# EAGLE design Board1 (EAGLE 7.5.0)
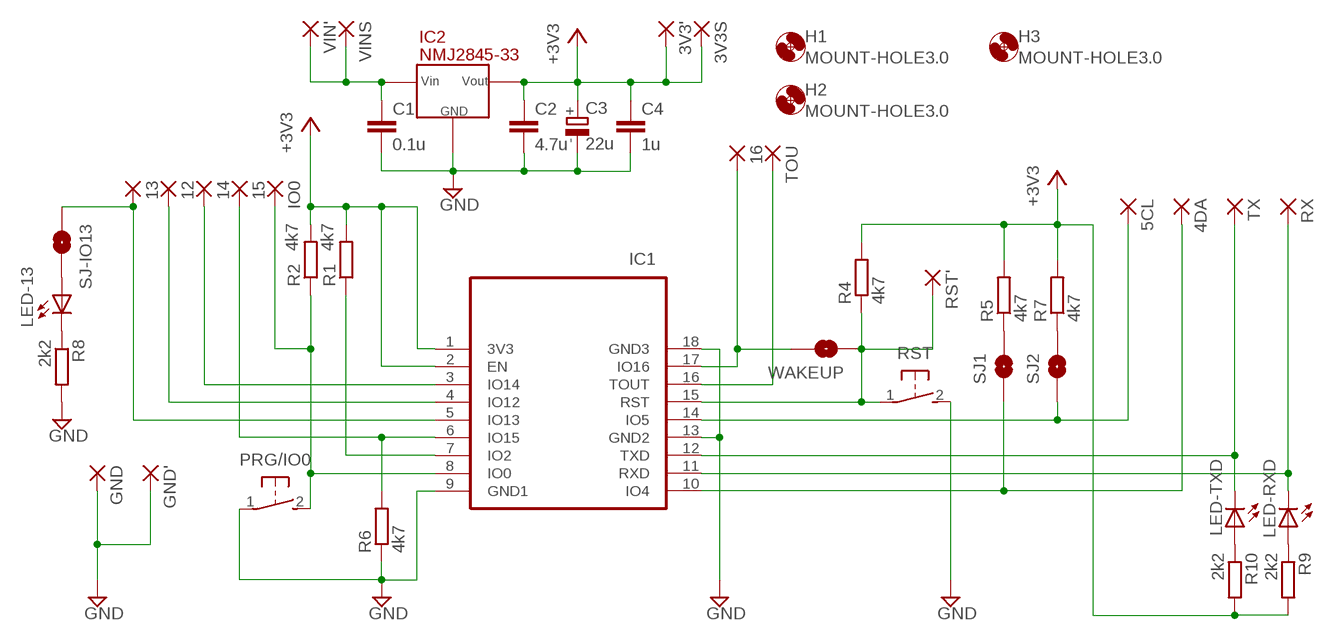
[diagram p0: schematic, sheet 1]

## Parts
3V3'  1,6/0,8  [1,6/0,8]
3V3S  1,6/0,8  [1,6/0,8]
4DA  1,6/0,8  [1,6/0,8]
5CL  1,6/0,8  [1,6/0,8]
12  1,6/0,8  [1,6/0,8]
13  1,6/0,8  [1,6/0,8]
14  1,6/0,8  [1,6/0,8]
15  1,6/0,8  [1,6/0,8]
16  1,6/0,8  [1,6/0,8]
C1  0.1u  C-EUC0603  [C0603]
C2  4.7u  C-EUC0805  [C0805]
C3  22u  OS-CON/C6C  [C6]
C4  1u  C-EUC0603  [C0603]
GND  1,6/0,8  [1,6/0,8]
GND'  1,6/0,8  [1,6/0,8]
H1  MOUNT-HOLE3.0  [3,0]
H2  MOUNT-HOLE3.0  [3,0]
H3  MOUNT-HOLE3.0  [3,0]
IC1  ESP-WROOM-02FRONT-FACE  [FRONT-FACE]
IC2  NMJ2845-33  NJM2845DL1  [TO-252-3]
IO0  1,6/0,8  [1,6/0,8]
LED-13  IO13  LEDCHIP-LED0603  [CHIP-LED0603]
LED-RXD  R  LEDCHIP-LED0603  [CHIP-LED0603]
LED-TXD  T  LEDCHIP-LED0603  [CHIP-LED0603]
PRG/IO0  SWITCH-TACTILESW  [SWITCH-TACTILE]
R1  4k7  R-EU_R0603  [R0603]
R2  4k7  R-EU_R0603  [R0603]
R4  4k7  R-EU_R0603  [R0603]
R5  4k7  R-EU_R0603  [R0603]
R6  4k7  R-EU_R0603  [R0603]
R7  4k7  R-EU_R0603  [R0603]
R8  2k2  R-EU_R0603  [R0603]
R9  2k2  R-EU_R0603  [R0603]
R10  2k2  R-EU_R0603  [R0603]
RST  SWITCH-TACTILESW  [SWITCH-TACTILE]
RST'  1,6/0,8  [1,6/0,8]
RX  1,6/0,8  [1,6/0,8]
SJ1  SDA/PU  SOLDERJUMPERNO  [SJ_2S-NO]
SJ2  SCL/PU  SOLDERJUMPERNO  [SJ_2S-NO]
SJ-IO13  SOLDERJUMPERNO  [SJ_2S-NO]
TOU  1,6/0,8  [1,6/0,8]
TX  1,6/0,8  [1,6/0,8]
VIN'  1,6/0,8  [1,6/0,8]
VINS  1,6/0,8  [1,6/0,8]
WAKEUP  SOLDERJUMPERNO  [SJ_2S-NO]

## Nets
+3V3 [3V3]: 3V3'.1(P) 3V3S.1(P) C2.1 C3.+ C4.1 IC1.1(3V3) IC1.2(EN) IC2.VOUT R1.2 R2.2 R4.2 R5.2 R7.2 R9.2 R10.2
GND [GND]: C1.2 C2.2 C3.- C4.2 GND'.1(P) GND.1(P) IC1.9(GND1) IC1.13(GND2) IC1.18(GND3) IC2.GND PRG/IO0.1 R6.1 R8.2 RST.2
N$2: IC1.8(IO0) IO0.1(P) PRG/IO0.2 R2.1
N$3: IC1.7(IO2) R1.1
N$4: 4DA.1(P) IC1.10(IO4) SJ1.1
N$5: IC1.11(RXD) LED-RXD.C RX.1(P)
N$6: IC1.12(TXD) LED-TXD.C TX.1(P)
N$7: 5CL.1(P) IC1.14(IO5) SJ2.1
N$8: IC1.15(RST) R4.1 RST'.1(P) RST.1 WAKEUP.1
N$9: IC1.16(TOUT) TOU.1(P)
N$10: 16.1(P) IC1.17(IO16) WAKEUP.2
N$11: R5.1 SJ1.2
N$12: R7.1 SJ2.2
N$13: 14.1(P) IC1.3(IO14)
N$14: 15.1(P) IC1.6(IO15) R6.2
N$15: 12.1(P) IC1.4(IO12)
N$16: 13.1(P) IC1.5(IO13) SJ-IO13.1
N$17 [Vin]: C1.1 IC2.VIN VIN'.1(P) VINS.1(P)
N$18: LED-13.A SJ-IO13.2
N$19: LED-13.C R8.1
N$22: LED-TXD.A R10.1
N$24: LED-RXD.A R9.1

## Library data of the parts
3V3' 3V3S 4DA 5CL 12-16 GND GND' IO0 RST' RX TOU TX VIN' VINS = wirepad:1,6/0,8: THROUGH-HOLE PAD
C1 C4 = _temp:C-EU: CAPACITOR, European symbol
C2 = resistor:C-EU: CAPACITOR, European symbol
C3 = OS-CON:OS-CON/C6
H1-H3 = holes:MOUNT-HOLE: MOUNTING HOLE with drill center marker
IC1 = esp-wroom-02:ESP-WROOM-02: WiFi module - ESP-WROOM-02
IC2 = NJM2845DL1:NJM2845DL1: New JRC NJM2845DL1 LDO Three-terminal regulator.
LED-13 LED-RXD LED-TXD = adafruit:LED: LED OSRAM: - CHIPLED LG R971, LG N971, LY N971, LG Q971, LY Q971, LO R971, LY R971 LH N974, LH R974 LS Q976, LO Q976, LY Q976 LO Q996 - Hyper CHIPLED LW Q18S LB Q993, LB Q99A, LB R99A - SideLED LS A670, LO A670, LY A670, LG A670, LP A670 LB A673, LV A673, LT A673, LW A673 LH A674 LY A675 LS A676, LA A676, LO A676, LY A676, LW A676 LS A679, LY A679, LG A679 - Hyper Micro SIDELED® LS Y876, LA Y876, LO Y876, LY Y876 LT Y87S - SmartLED LW L88C, LW L88S LB L89C, LB L89S, LG L890 LS L89K, LO L89K, LY L89K LS L896, LA L896, LO L896, LY L896 - TOPLED LS T670, LO T670, LY T670, LG T670, LP T670 LSG T670, LSP T670, LSY T670, LOP T670, LYG T670 LG T671, LOG T671, LSG T671 LB T673, LV T673, LT T673, LW T673 LH T674 LS T676, LA T676, LO T676, LY T676, LB T676, LH T676, LSB T676, LW T676 LB T67C, LV T67C, LT T67C, LS T67K, LO T67K, LY T67K, LW E67C LS E67B, LA E67B, LO E67B, LY E67B, LB E67C, LV E67C, LT E67C LW T67C LS T679, LY T679, LG T679 LS T770, LO T770, LY T770, LG T770, LP T770 LB T773, LV T773, LT T773, LW T773 LH T774 LS E675, LA E675, LY E675, LS T675 LS T776, LA T776, LO T776, LY T776, LB T776 LHGB T686 LT T68C, LB T68C - Hyper Mini TOPLED® LB M676 - Mini TOPLED Santana® LG M470 LS M47K, LO M47K, LY M47K Source: http://www.osram.convergy.de/
PRG/IO0 RST = tact-switch-2p:SWITCH-TACTILE: tactile switch - 2p
R1 R2 R4-R10 = _temp:R-EU_: RESISTOR, European symbol
SJ1 SJ2 SJ-IO13 WAKEUP = SparkFun:SOLDERJUMPER: Solder Jumper Standard SMD solder jumper. Used to automate production. Two varients : Normally Open and Normally Closed are the same, but have different paste layers. NC will have a large amount of paste and should jumper during reflow.

## Net classes
1 GND: width 0.61 mm
2 3V3: width 0.61 mm
3 Vin: width 0.61 mm

## Board
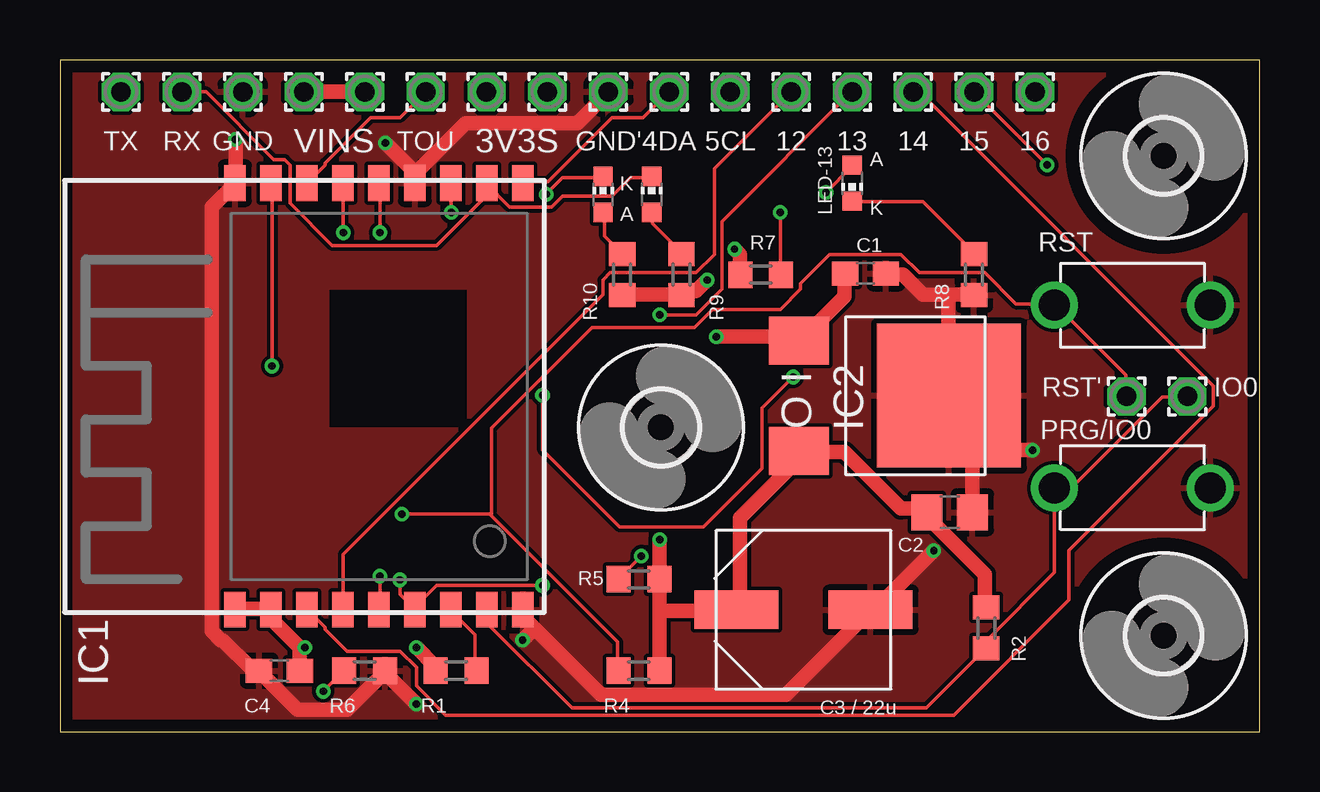
[diagram p1: board, top side]
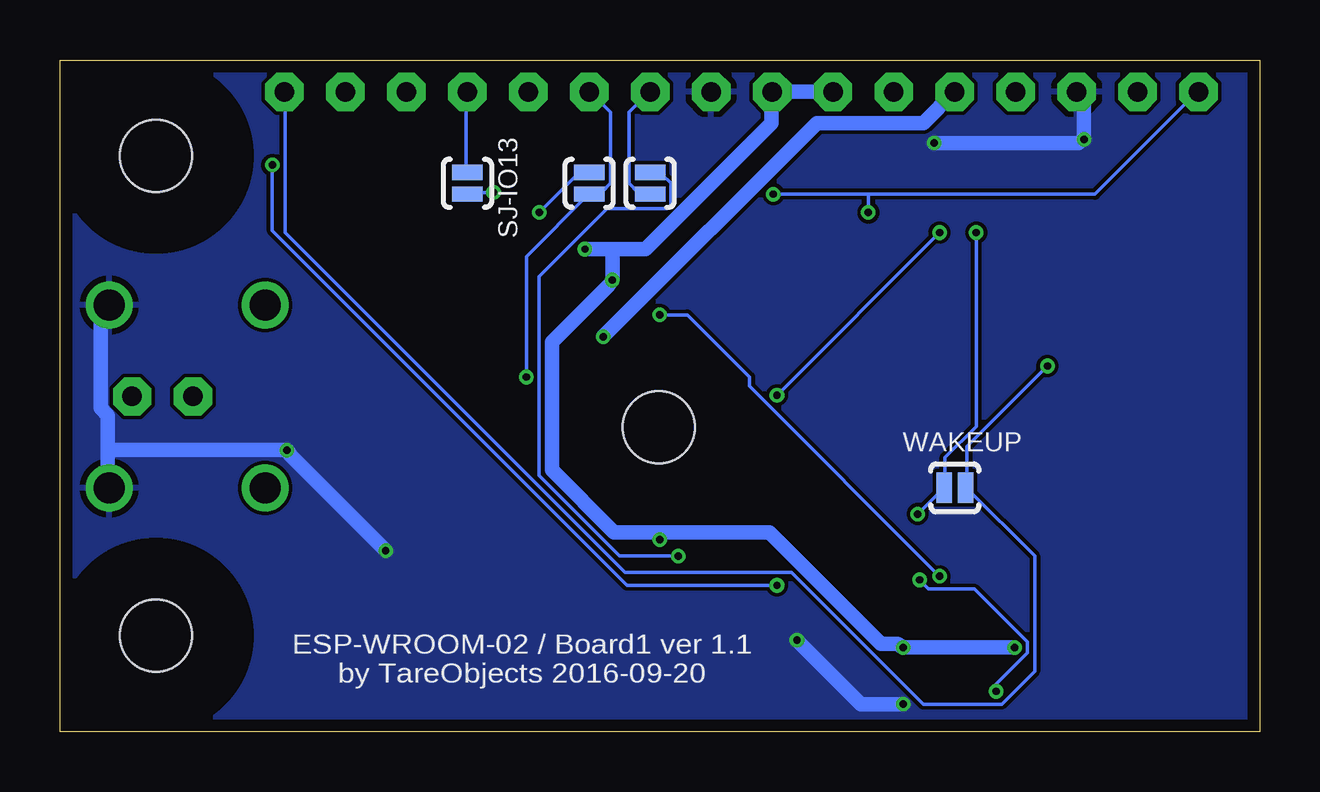
[diagram p2: board, bottom side, seen from below]

Size 50 x 28 mm. Coordinates in mm from the lower left corner, seen from the top.
Outline: 0,0 50,0 50,28 0,28 0,0
Copper layers (1*16): Top 0.035mm / dielectric 1.6mm / Bottom 0.035mm
Design rules "Elecrow_2-layer_PCB_eagle_rule": minimum track width 6mil, minimum drill 12mil, track to track 6mil, track to pad 6mil, pad to pad 6mil, via to via 8mil, smd to smd 0mil, copper to edge 20mil, drill to drill 10mil, minimum pad ring 6mil, minimum via ring 6mil, stop-mask expansion 0mil, vias tented up to drill 100mil, thermal gap 10mil

### Footprints (pad centres in the part's own frame; a part is rotated, then mirrored left to right if it is on the bottom)
1,6/0,8 = drill 0.813 pad 1.6 octagon: 1 0,0
C0603 = smd 1.1 x 1: 1 -0.85,0; 2 0.85,0
C0805 = smd 1.3 x 1.5: 1 -0.95,0; 2 0.95,0
C6 = smd 1.6 x 3.5: + 0,-2.8; - 0,2.8
3,0 = hole 3: 0,0
FRONT-FACE = smd 1.485 x 0.9: 1 -8.893,4.9; 2 -8.893,3.4; 3 -8.893,1.9; 4 -8.893,0.4; 5 -8.893,-1.1; 6 -8.893,-2.6; 7 -8.893,-4.1; 8 -8.893,-5.6; 9 -8.893,-7.1; 10 8.893,-7.1; 11 8.893,-5.6; 12 8.893,-4.1; 13 8.893,-2.6; 14 8.893,-1.1; 15 8.893,0.4; 16 8.893,1.9; 17 8.893,3.4; 18 8.893,4.9
TO-252-3 = smd 6 x 6: GND 0,1.5 | smd 2 x 2.5: VIN -2.3,-4.75; VOUT 2.3,-4.75
CHIP-LED0603 = smd 0.8 x 0.8: A 0,-0.75; C 0,0.75
SWITCH-TACTILE = drill 1.3: 1 -3.25,0; 2 3.25,0
R0603 = smd 1 x 1.1: 1 -0.85,0; 2 0.85,0
SJ_2S-NO = smd 0.635 x 1.27: 1 -0.45,0; 2 0.45,0

### Placement (x,y rotation side)
3V3'  17.78,26.67 0 top
3V3S  20.32,26.67 180 top
4DA  25.4,26.67 180 top
5CL  27.94,26.67 0 top
12  30.48,26.67 180 top
13  33.02,26.67 180 top
14  35.56,26.67 180 top
15  38.1,26.67 0 top
16  40.64,26.67 180 top
C1  33.58,19.1 0 top
C2  37.08,9.14 0 top
C3  30.99,5.08 270 top
C4  9.14,2.54 180 top
GND  7.62,26.67 0 top
GND'  22.86,26.67 0 top
H1  46,4 0 top
H2  46,24 0 top
H3  25.05,12.68 0 top
IC1  12.19,13.97 90 top
IC2  35.56,14 270 top
IO0  46.99,13.97 0 top
LED-13  33.02,22.86 180 top
LED-RXD  24.67,22.4 0 top
LED-TXD  22.64,22.4 0 top
PRG/IO0  44.7,10.16 180 top
R1  16.51,2.54 180 top
R2  38.61,4.32 90 top
R4  24.13,2.54 0 top
R5  24.13,6.35 0 top
R6  12.7,2.54 180 top
R7  29.21,19.05 180 top
R8  38.1,19.05 270 top
R9  25.91,19.05 270 top
R10  23.43,19.05 270 top
RST  44.7,17.78 0 top
RST'  44.45,13.97 0 top
RX  5.08,26.67 90 top
SJ1  25.4,22.86 90 bottom
SJ2  27.94,22.86 90 bottom
SJ-IO13  33.02,22.86 270 bottom
TOU  15.24,26.67 180 top
TX  2.54,26.67 90 top
VIN'  12.7,26.67 0 top
VINS  10.16,26.67 180 top
WAKEUP  12.7,10.16 0 bottom

### Tracks (layer width: path | path; a pad name or v marks a point on that pad's centre or on a via)
+3V3  (via drill 0.3)
  Top 0.61: 24.99,5.03 24.99,6.33 R5.2 24.99,6.63 v24.99,8 | 24.99,5.03 24.99,2.59 R4.2 | 24.99,5.03 28.12,5.03 C3.+ 28.35,5.33 28.35,8.91 30.79,11.35 IC2.VOUT 30.86,11.66 32.69,11.66 35.05,9.3 35.89,9.3 C2.1 36.2,9.14 36.2,8.91 38.56,6.55 38.56,5.18 R2.2 | 9.98,3.5 9.98,2.59 C4.1 | 9.98,3.5 8.84,4.65 8.84,5.03 IC1.2 8.53,5.11 7.32,5.11 IC1.1 | v14.86,3.5 15.62,2.74 15.62,2.59 R1.2 | v10.21,3.5 9.98,3.5 | R10.2 23.47,18.21 25.91,18.21 R9.2 26.14,18.36 26.52,18.36 v26.98,18.82 | v28.12,20.12 28.35,19.89 28.35,19.05 R7.2
  Bottom 0.61: v10.21,3.5 v14.86,3.5 15.09,3.66 15.77,3.66 20.42,8.31 24.99,8.31 | 26.98,20.12 25.6,20.12 20.34,25.38 20.34,26.67 3V3S.1 3V3'.1 | 26.98,20.12 v28.12,20.12 | 26.98,20.12 v26.98,18.82 27.13,18.59 29.49,16.23 29.49,10.9 26.9,8.31 24.99,8.31 | v24.99,8 24.99,8.31
GND  (via drill 0.3)
  Top 0.61: GND'.1 21.57,25.38 16.92,25.38 14.86,23.32 14.86,22.94 IC1.13 14.63,23.47 v13.56,24.54 | v7.32,24.69 7.32,22.94 IC1.18 7.09,22.63 6.33,21.87 6.33,4.19 6.71,3.81 6.78,3.81 8,2.59 C4.2 8.31,2.52 9.91,0.91 11.96,0.91 13.56,2.52 R6.1 13.72,2.29 v14.86,1.14 | 19.77,4.3 22.55,1.52 30.25,1.52 33.76,5.03 C3.- 34.06,5.18 v36.42,7.54 | 19.77,4.3 19.36,4.72 19.36,5.03 IC1.9 | 37.03,18.21 38.1,18.21 R8.2 | 37.03,18.21 35.97,18.21 35.13,19.05 34.44,19.05 C1.2 | C2.2 38.02,13.03 37.11,13.95 IC2.GND | 37.03,18.21 37.03,14.25 IC2.GND | v40.54,11.73 38.25,11.73 IC2.GND | 19.77,4.3 v19.28,3.81
  Bottom 0.61: GND.1 7.32,26.36 v7.32,24.69 7.54,24.54 v13.56,24.54 | 48.01,11.73 48.01,13.18 48.31,13.49 48.31,17.45 48.01,17.75 RST.2 | 48.01,11.73 48.01,10.21 PRG/IO0.1 | 48.01,11.73 v40.54,11.73 40.39,11.51 v36.42,7.54 | v14.86,1.14 16.61,1.14 v19.28,3.81
  pour Top: 0,0 50.8,0 50.8,27.94 0,27.94
  pour Bottom: 0,0 52.07,0 52.07,27.94 0,27.94
N$2
  Top 0.152: IC1.8 17.83,5.03 17.83,4.5 21.34,0.99 36.12,0.99 38.56,3.43 R2.1 38.63,3.5 38.63,3.81 41.45,6.63 41.45,10.13 PRG/IO0.2 41.53,10.21 42.22,10.21 45.95,13.95 46.94,13.95 IO0.1
N$3
  Top 0.152: R1.1 17.3,2.59 17.3,4.04 16.31,5.03 IC1.7
N$4
  Top 0.152: IC1.10 19.36,22.94 20.34,22.94 23.01,25.6 24.31,25.6 25.38,26.67 4DA.1
  Bottom 0.152: SJ1.1 25.45,22.48 25.91,22.48 26.29,22.86 26.29,25.83 25.45,26.67 4DA.1
N$5
  Top 0.152: LED-RXD.C 24.61,23.09 23.77,23.09 23.01,22.33 20.95,22.33 20.5,21.87 18.75,21.87 17.75,22.86 IC1.11 17.98,22.55 15.7,20.27 11.35,20.27 9.6,22.02 9.6,23.62 9.37,23.85 8.91,23.85 6.1,26.67 RX.1
N$6  (via drill 0.3)
  Top 0.152: v20.27,22.4 20.95,23.09 22.63,23.09 LED-TXD.C | v16.31,21.64 16.31,22.86 IC1.12
  Bottom 0.152: 16.31,22.4 6.86,22.4 2.59,26.67 TX.1 | 16.31,22.4 v20.27,22.4 | 16.31,22.4 v16.31,21.64
N$7  (via drill 0.3)
  Top 0.152: v13.34,20.8 13.34,22.86 IC1.14 | v20.12,14.02 20.12,11.73 23.32,8.53 26.82,8.53 29.26,10.97 29.26,13.49 v30.56,14.78
  Bottom 0.152: 5CL.1 27.89,26.67 27.05,25.83 27.05,22.86 27.43,22.48 27.89,22.48 SJ2.1 27.96,22.4 30.56,19.81 v30.56,14.78 | v20.12,14.02 v13.34,20.8
N$8  (via drill 0.3)
  Top 0.152: RST'.1 44.42,14.02 44.42,14.86 41.53,17.75 RST.1 41.45,17.83 39.85,17.83 38.56,19.13 35.81,19.13 35.05,19.89 32.08,19.89 30.86,18.67 30.86,18.44 30.02,17.6 27.2,17.6 26.44,16.84 22.17,16.84 17.98,12.65 17.98,9.07 17.95,9.03 | 17.95,9.03 17.91,9.07 v14.25,9.07 | 17.95,9.03 23.24,3.73 23.24,2.59 R4.1 | v11.81,20.8 11.81,22.86 IC1.15
  Bottom 0.152: v14.25,9.07 13.18,10.13 WAKEUP.1 13.11,10.21 13.11,11.43 11.81,12.72 v11.81,20.8
N$9
  Top 0.152: TOU.1 14.17,25.6 12.95,25.6 11.05,23.7 11.05,23.62 10.36,22.94 IC1.16
N$10  (via drill 0.3)
  Top 0.152: v8.84,15.24 8.84,22.86 IC1.17
  Bottom 0.152: v8.84,15.24 12.19,11.89 12.19,10.21 WAKEUP.2 12.19,10.13 9.37,7.32 9.37,2.52 10.74,1.14 14.02,1.14 19.51,6.63 26.44,6.63 40.62,20.8 40.62,26.67 16.1
N$11  (via drill 0.3)
  Top 0.152: v24.23,7.32 23.32,6.4 R5.1
  Bottom 0.152: v24.23,7.32 26.67,7.32 30.02,10.67 30.02,18.97 27.2,21.79 24.69,21.79 24.54,21.95 24.54,22.86 24.92,23.24 25.38,23.24 SJ1.2
N$12  (via drill 0.3)
  Top 0.152: v30.02,21.64 30.02,19.05 R7.1
  Bottom 0.152: v30.02,21.64 28.42,23.24 27.96,23.24 SJ2.2
N$13
  Top 0.152: 14.1 35.81,26.67 48.08,14.4 48.08,13.56 42.06,7.54 42.06,5.49 37.26,0.69 16.08,0.69 14.86,1.91 14.86,2.67 14.17,3.35 11.96,3.35 11.05,4.27 11.05,4.34 10.36,5.03 IC1.3
N$14  (via drill 0.3)
  Top 0.152: v10.97,1.68 11.81,2.52 R6.2 | v14.17,6.33 14.17,5.71 14.78,5.11 IC1.6 14.78,5.18 15.7,6.1 v20.12,6.1 | v41.15,23.62 15.1
  Bottom 0.152: v10.97,1.68 10.97,1.98 9.68,3.28 9.68,3.73 11.89,5.94 13.79,5.94 v14.17,6.33 | v41.15,23.62 41.15,20.88 26.36,6.1 v20.12,6.1
N$15
  Top 0.152: 12.1 27.28,23.47 27.28,19.89 26.52,19.13 22.94,19.13 22.63,18.82 22.63,18.21 11.81,7.39 11.81,5.11 IC1.4
N$16  (via drill 0.3)
  Top 0.152: v13.34,6.48 13.34,5.11 IC1.5 | v24.99,17.37 26.52,17.37 27.58,18.44 27.58,21.26 32.99,26.67 13.1
  Bottom 0.152: SJ-IO13.1 33.07,23.32 33.07,26.67 13.1 | v13.34,6.48 21.26,14.4 21.26,14.78 23.85,17.37 v24.99,17.37
N$17  (via drill 0.3)
  Top 0.61: C1.1 32.69,19.05 32.69,18.14 30.86,16.31 IC2.VIN 30.56,16.46 v27.36,16.46 | VIN'.1 VINS.1
  Bottom 0.61: v27.36,16.46 18.44,25.38 14.02,25.38 12.72,26.67 VIN'.1
N$18  (via drill 0.3)
  Top 0.152: v31.93,22.48 32.99,23.55 LED-13.A
  Bottom 0.152: v31.93,22.48 32.99,22.48 SJ-IO13.2
N$19
  Top 0.152: LED-13.C 33.07,22.1 35.97,22.1 38.1,19.96 R8.1
N$22
  Top 0.152: LED-TXD.A 22.71,21.64 22.71,20.65 23.39,19.96 R10.1
N$24
  Top 0.152: LED-RXD.A 24.69,21.64 24.69,21.18 25.91,19.96 R9.1

### Text on the board
tNames: A | K | A | K | C3 / 22u
bNames: ESP-WROOM-02 / Board1 ver 1.1 / by TareObjects 2016-09-20